# Altium schematic sheet Analogue_Output.SchDoc
size A2; SheetNumber: 15; SheetTotal: 29
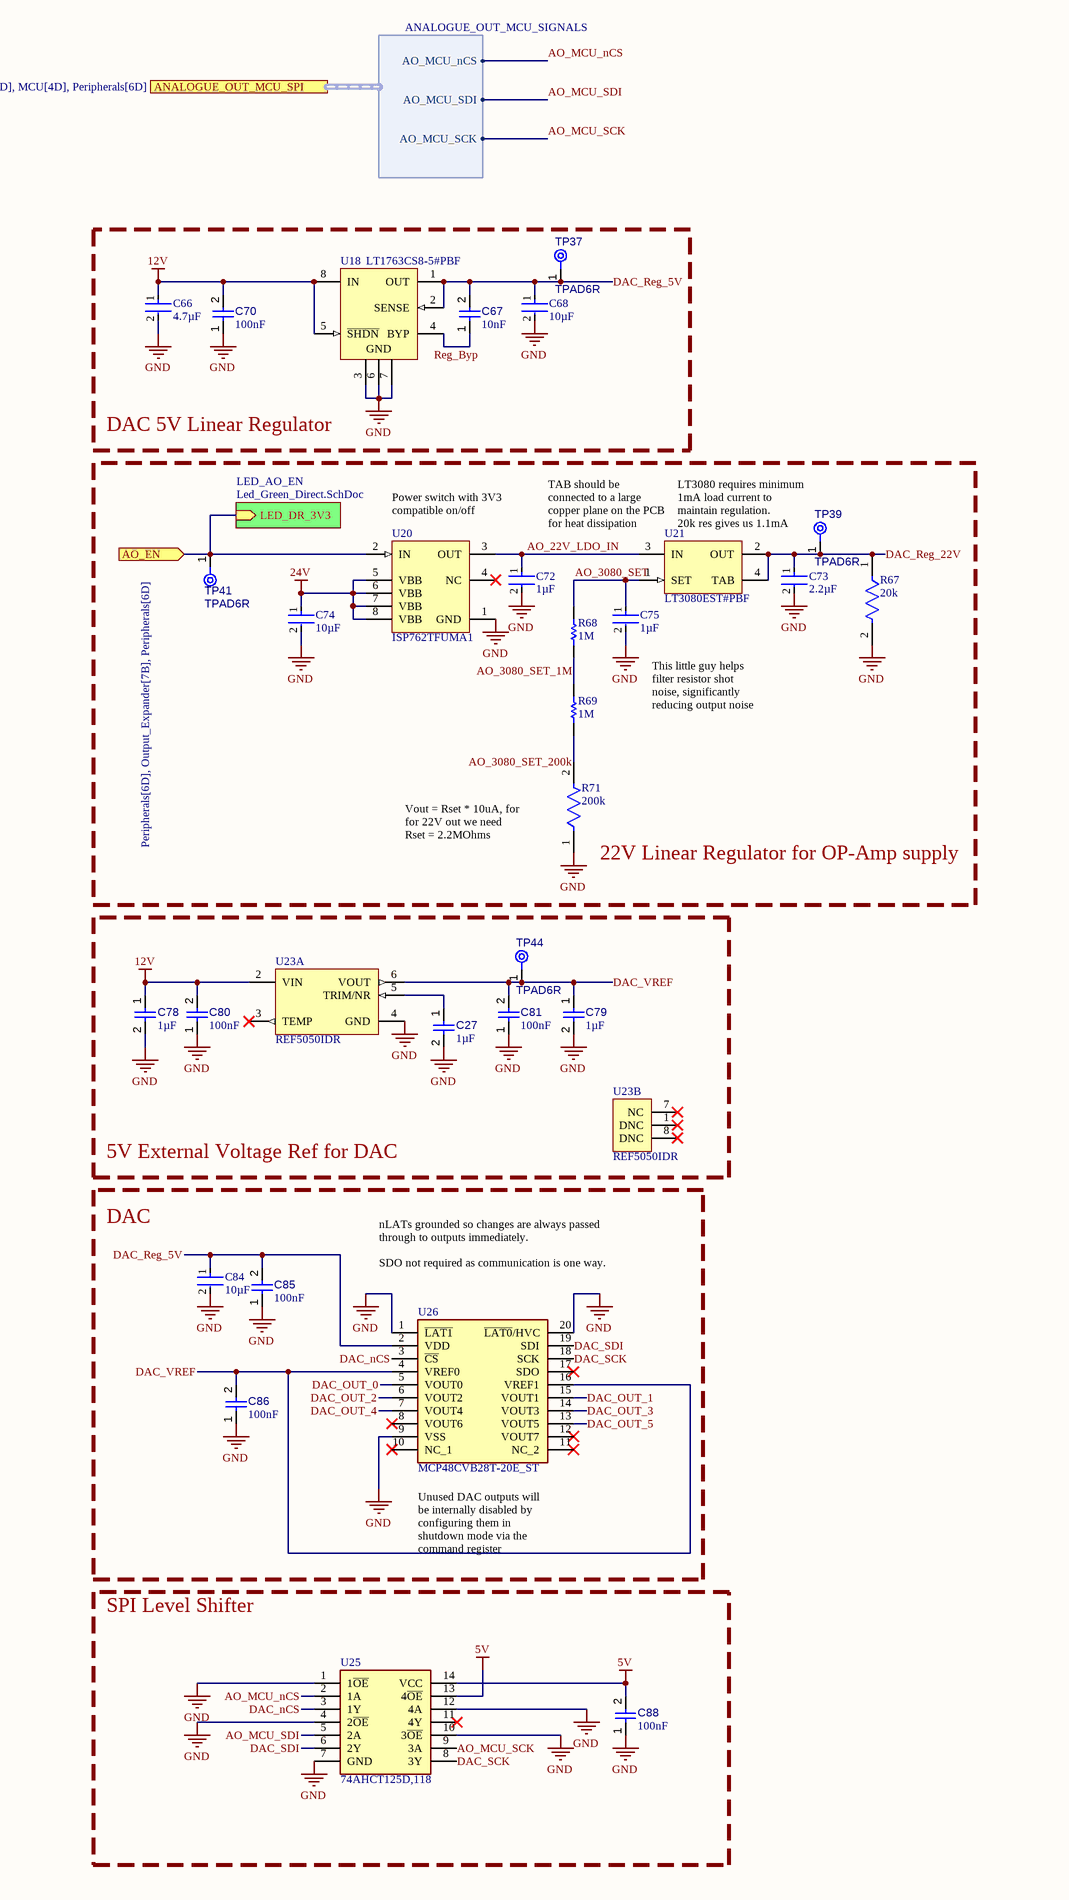
[diagram p0: Analogue_Output.SchDoc, left]
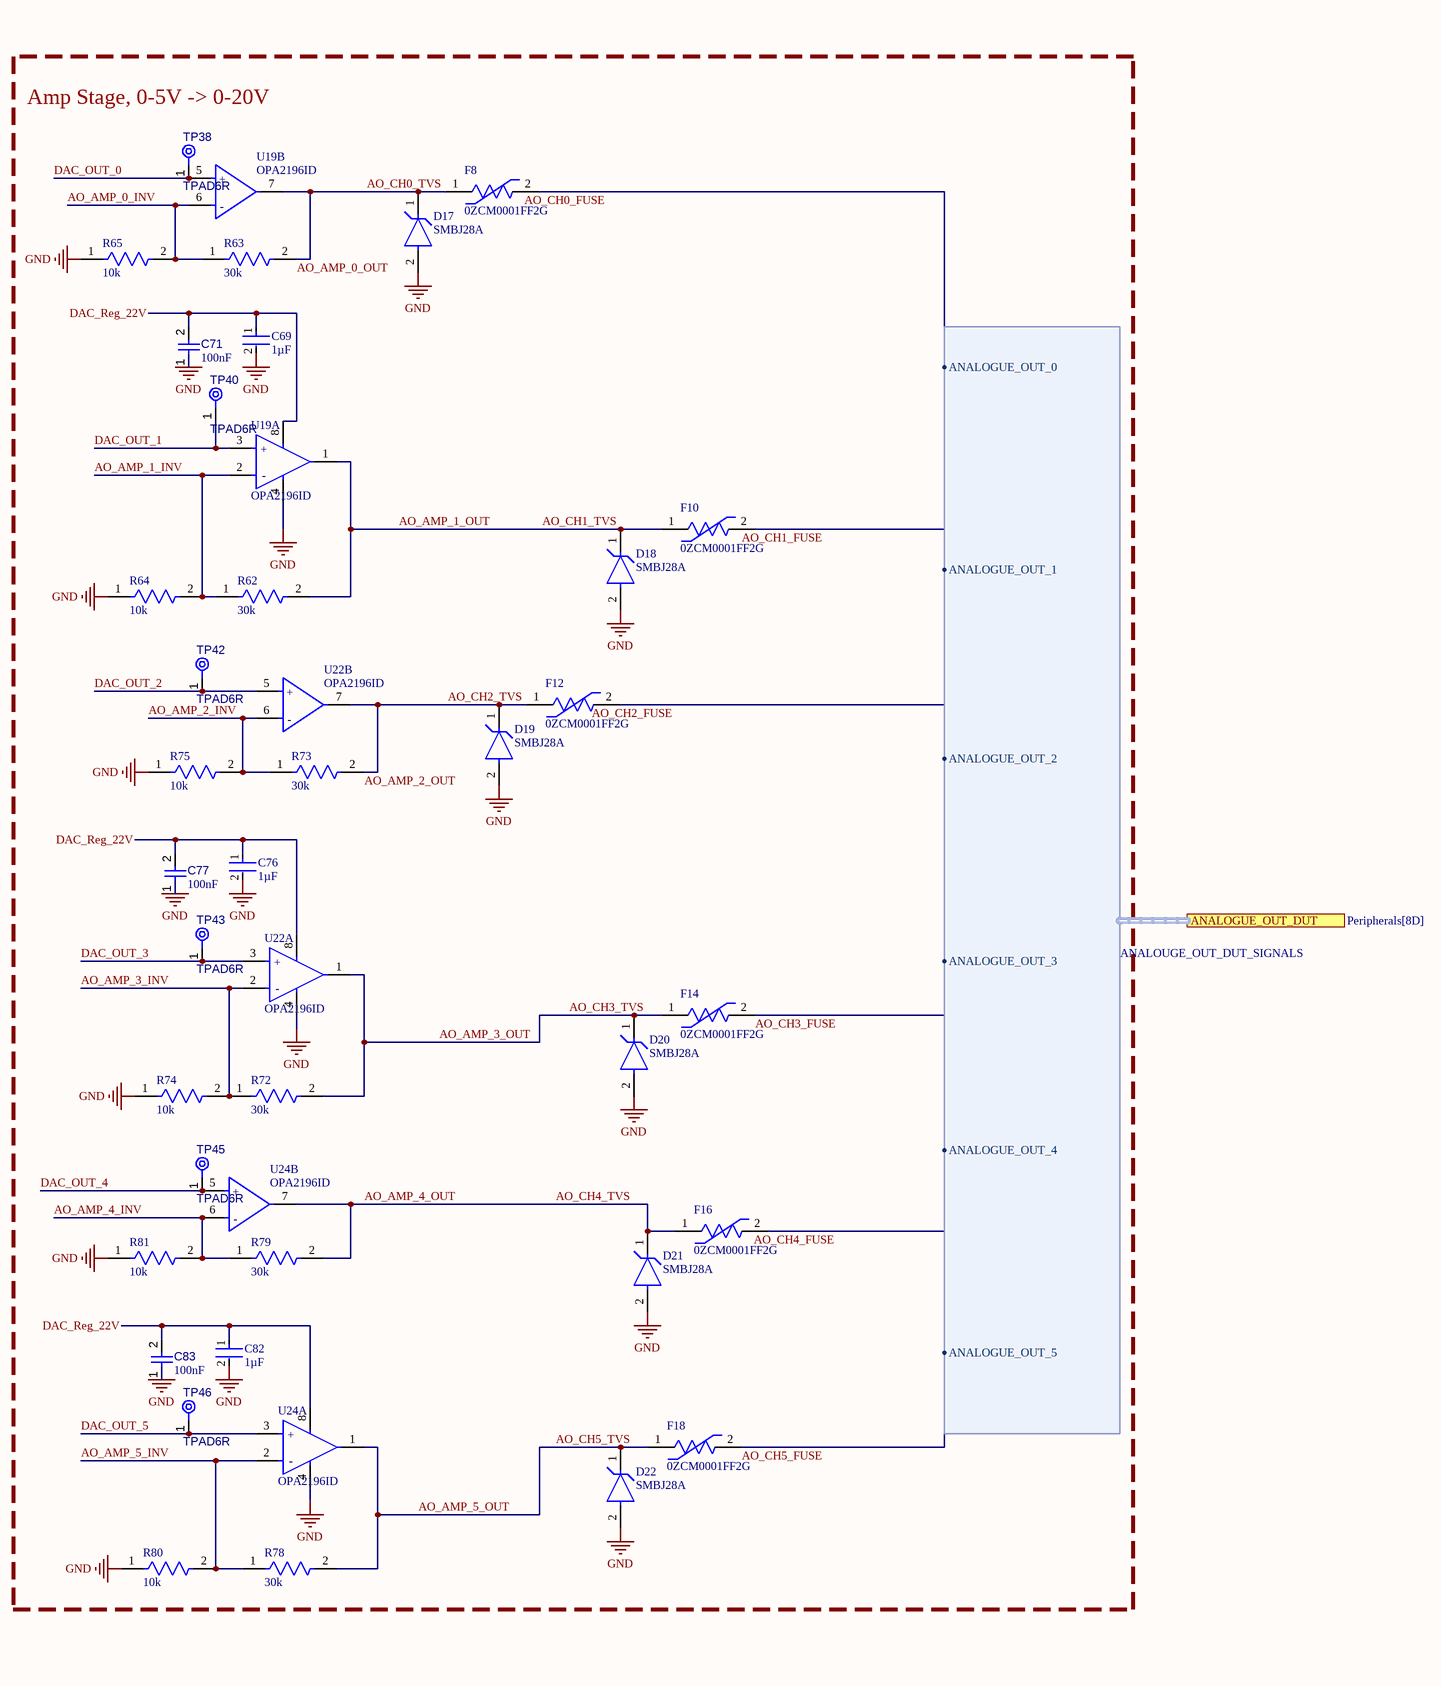
[diagram p1: Analogue_Output.SchDoc, right]

## Parts
C27  value 1µF  [CAPC1608X90X40LL10T20]  (hidden comment: Capacitor 1 uF +/- 10% 25 V 0603)
C66  value 4.7µF  [FP-GRM21B-0_2-e0_2_0_7-MFG]  (hidden comment: GRM21BZ71H475KE15L)
C67  value 10nF  [CAPC0402(1005)60_L]  (hidden comment: Capacitor 10nF +/-20% 50V 0402)
C68  value 10µF  [FP-GRM31C-0_2-e0_3_0_8-IPC_C]  (hidden comment: GRM31CR71E106KA12L)
C69  value 1µF  [FP-CC0603-DB-IPC_B]  (hidden comment: CC0603KRX7R9BB105)
C70  value 100nF  [CAPC1608X90X40NL10T20]  (hidden comment: Capacitor 100 nF +/-10% 50 V 0603)
C71  value 100nF  [CAPC1608X90X40NL10T20]  (hidden comment: Capacitor 100 nF +/-10% 50 V 0603)
C72  value 1µF  [FP-CC0603-DB-IPC_B]  (hidden comment: CC0603KRX7R9BB105)
C73  value 2.2µF  [FP-CC0805-0_85-IPC_A]  (hidden comment: CC0805KKX5R9BB225)
C74  value 10µF  [FP-GRM188-0_2-IPC_C]  (hidden comment: GRM188R6YA106MA73D)
C75  value 1µF  [FP-CC0603-DB-IPC_B]  (hidden comment: CC0603KRX7R9BB105)
C76  value 1µF  [FP-CC0603-DB-IPC_B]  (hidden comment: CC0603KRX7R9BB105)
C77  value 100nF  [CAPC1608X90X40NL10T20]  (hidden comment: Capacitor 100 nF +/-10% 50 V 0603)
C78  value 1µF  [CAPC1608X90X40LL10T20]  (hidden comment: Capacitor 1 uF +/- 10% 25 V 0603)
C79  value 1µF  [CAPC1608X90X40LL10T20]  (hidden comment: Capacitor 1 uF +/- 10% 25 V 0603)
C80  value 100nF  [CAPC1608X90X40NL10T20]  (hidden comment: Capacitor 100 nF +/-10% 50 V 0603)
C81  value 100nF  [CAPC1608X90X40NL10T20]  (hidden comment: Capacitor 100 nF +/-10% 50 V 0603)
C82  value 1µF  [FP-CC0603-DB-IPC_B]  (hidden comment: CC0603KRX7R9BB105)
C83  value 100nF  [CAPC1608X90X40NL10T20]  (hidden comment: Capacitor 100 nF +/-10% 50 V 0603)
C84  value 10µF  [FP-GRM31C-0_2-e0_3_0_8-IPC_C]  (hidden comment: GRM31CR71E106KA12L)
C85  value 100nF  [CAPC1608X90X40NL10T20]  (hidden comment: Capacitor 100 nF +/-10% 50 V 0603)
C86  value 100nF  [CAPC1608X90X40NL10T20]  (hidden comment: Capacitor 100 nF +/-10% 50 V 0603)
C88  value 100nF  [CAPC1608X90X40NL10T20]  (hidden comment: Capacitor 100 nF +/-10% 50 V 0603)
D17  SMBJ28A  [FP-SMBJ-MFG]
D18  SMBJ28A  [FP-SMBJ-MFG]
D19  SMBJ28A  [FP-SMBJ-MFG]
D20  SMBJ28A  [FP-SMBJ-MFG]
D21  SMBJ28A  [FP-SMBJ-MFG]
D22  SMBJ28A  [FP-SMBJ-MFG]
F8  0ZCM0001FF2G  [FP-0ZCM0001FF2G-MFG]
F10  0ZCM0001FF2G  [FP-0ZCM0001FF2G-MFG]
F12  0ZCM0001FF2G  [FP-0ZCM0001FF2G-MFG]
F14  0ZCM0001FF2G  [FP-0ZCM0001FF2G-MFG]
F16  0ZCM0001FF2G  [FP-0ZCM0001FF2G-MFG]
F18  0ZCM0001FF2G  [FP-0ZCM0001FF2G-MFG]
R62  value 30k  [FP-RT0603-IPC_C]  (hidden comment: RT0603BRE0730KL)
R63  value 30k  [FP-RT0603-IPC_C]  (hidden comment: RT0603BRE0730KL)
R64  value 10k  [FP-RT0603-IPC_C]  (hidden comment: RT0603BRD0710KL)
R65  value 10k  [FP-RT0603-IPC_C]  (hidden comment: RT0603BRD0710KL)
R67  value 20k  [FP-RT0603-IPC_C]  (hidden comment: RT0603DRD0720KL)
R68  value 1M  [RESC2013X60X35ML10T20]  (hidden comment: RT0805BRD071ML)
R69  value 1M  [RESC2013X60X35ML10T20]  (hidden comment: RT0805BRD071ML)
R71  value 200k  [FP-AT0603-IPC_A]  (hidden comment: AT0603BRD07200KL)
R72  value 30k  [FP-RT0603-IPC_C]  (hidden comment: RT0603BRE0730KL)
R73  value 30k  [FP-RT0603-IPC_C]  (hidden comment: RT0603BRE0730KL)
R74  value 10k  [FP-RT0603-IPC_C]  (hidden comment: RT0603BRD0710KL)
R75  value 10k  [FP-RT0603-IPC_C]  (hidden comment: RT0603BRD0710KL)
R78  value 30k  [FP-RT0603-IPC_C]  (hidden comment: RT0603BRE0730KL)
R79  value 30k  [FP-RT0603-IPC_C]  (hidden comment: RT0603BRE0730KL)
R80  value 10k  [FP-RT0603-IPC_C]  (hidden comment: RT0603BRD0710KL)
R81  value 10k  [FP-RT0603-IPC_C]  (hidden comment: RT0603BRD0710KL)
TP37  TPAD6R  [TP06R]  (no BOM)
TP38  TPAD6R  [TP06R]  (no BOM)
TP39  TPAD6R  [TP06R]  (no BOM)
TP40  TPAD6R  [TP06R]  (no BOM)
TP41  TPAD6R  [TP06R]  (no BOM)
TP42  TPAD6R  [TP06R]  (no BOM)
TP43  TPAD6R  [TP06R]  (no BOM)
TP44  TPAD6R  [TP06R]  (no BOM)
TP45  TPAD6R  [TP06R]  (no BOM)
TP46  TPAD6R  [TP06R]  (no BOM)
U18  LT1763CS8-5#PBF  [LT-S8-8_N]
U19  OPA2196ID  [FP-D0008A-IPC_B]  (parts A,B of 2)
U20  ISP762TFUMA1  [INF-PG-DSO-8-3_L]
U21  LT3080EST#PBF  [LT-ST-3-SOT-223_M]
U22  OPA2196ID  [FP-D0008A-IPC_B]  (parts A,B of 2)
U23  REF5050IDR  [D0008A_L]  (parts A,B of 2)
U24  OPA2196ID  [FP-D0008A-IPC_B]  (parts A,B of 2)
U25  74AHCT125D,118  [SOIC127P600X175-14N]
U26  MCP48CVB28T-20E_ST  [SOP65P640X120-20N]

## Blocks framed on the sheet
DAC 5V Linear Regulator: C66-C68 C70 TP37 U18
Amp Stage, 0-5V -> 0-20V: C69 C71 C76 C77 C82 C83 D17-D22 F8 F10 F12 F14 F16 F18 R62-R65 R72-R75 R78-R81 TP38 TP40 TP42 TP43 TP45 TP46 U19 U22 U24
22V Linear Regulator for OP-Amp supply: C72-C75 R67-R69 R71 TP39 TP41 U20 U21
5V External Voltage Ref for DAC: C27 C78-C81 TP44 U23
DAC: C84-C86 U26
SPI Level Shifter: C88 U25

## Sub-sheets
LED_AO_EN = Led_Green_Direct.SchDoc: LED_DR_3V3 (in)

## Ports
ANALOGUE_OUT_DUT (harness ANALOUGE_OUT_DUT_SIGNALS, see Peripherals[8D]), ANALOGUE_OUT_MCU_SPI (harness ANALOGUE_OUT_MCU_SIGNALS, see Peripherals[6D], MCU[4D], Peripherals[6D]), AO_EN (in, see Peripherals[6D], Output_Expander[7B], Peripherals[6D])

## Harnesses
ANALOGUE_OUT_MCU_SIGNALS: AO_MCU_nCS, AO_MCU_SDI, AO_MCU_SCK
ANALOUGE_OUT_DUT_SIGNALS: ANALOGUE_OUT_0, ANALOGUE_OUT_1, ANALOGUE_OUT_2, ANALOGUE_OUT_3, ANALOGUE_OUT_4, ANALOGUE_OUT_5

## Nets
5V: C88.2 U25.13(4~{OE}) U25.14(VCC)
12V: C66.1 C70.2 C78.1 C80.2 U18.5(~{SHDN}) U18.8(IN) U23.2(VIN)
24V: C74.1 U20.5(VBB) U20.6(VBB) U20.7(VBB) U20.8(VBB)
GND: C27.2 C66.2 C68.2 C69.2 C70.1 C71.1 C72.2 C73.2 C74.2 C75.2 C76.2 C77.1 C78.2 C79.2 C80.1 C81.1 C82.2 C83.1 C84.2 C85.1 C86.1 C88.1 D17.2(A) D18.2(A) D19.2(A) D20.2(A) D21.2(A) D22.2(A) R64.1 R65.1 R67.2 R71.1 R74.1 R75.1 R80.1 R81.1 U18.3(GND) U18.6(GND) U18.7(GND) U19.4(V-) U20.1(GND) U22.4(V-) U23.4(GND) U24.4(V-) U25.1(1~{OE}) U25.4(2~{OE}) U25.7(GND) U25.10(3~{OE}) U25.12(4A) U26.1(~{LAT1}) U26.9(VSS) U26.20(~{LAT0}/HVC)
AO_22V_LDO_IN: C72.1 U20.3(OUT) U21.3(IN)
AO_3080_SET: C75.1 R68.1 U21.1(SET)
AO_3080_SET_1M: R68.2 R69.1
AO_3080_SET_200k: R69.2 R71.2
AO_AMP_0_INV: R63.1 R65.2 U19.6(-IN_B)
AO_AMP_0_OUT: D17.1(C) F8.1 R63.2 U19.7(OUT_B)  [also labelled AO_CH0_TVS]
AO_AMP_1_INV: R62.1 R64.2 U19.2(-IN_A)
AO_AMP_1_OUT: D18.1(C) F10.1 R62.2 U19.1(OUT_A)  [also labelled AO_CH1_TVS]
AO_AMP_2_INV: R73.1 R75.2 U22.6(-IN_B)
AO_AMP_2_OUT: D19.1(C) F12.1 R73.2 U22.7(OUT_B)  [also labelled AO_CH2_TVS]
AO_AMP_3_INV: R72.1 R74.2 U22.2(-IN_A)
AO_AMP_3_OUT: D20.1(C) F14.1 R72.2 U22.1(OUT_A)  [also labelled AO_CH3_TVS]
AO_AMP_4_INV: R79.1 R81.2 U24.6(-IN_B)
AO_AMP_4_OUT: D21.1(C) F16.1 R79.2 U24.7(OUT_B)  [also labelled AO_CH4_TVS]
AO_AMP_5_INV: R78.1 R80.2 U24.2(-IN_A)
AO_AMP_5_OUT: D22.1(C) F18.1 R78.2 U24.1(OUT_A)  [also labelled AO_CH5_TVS]
AO_CH0_FUSE: F8.2 ; port ANALOGUE_OUT_DUT.ANALOGUE_OUT_0
AO_CH1_FUSE: F10.2 ; port ANALOGUE_OUT_DUT.ANALOGUE_OUT_1
AO_CH2_FUSE: F12.2 ; port ANALOGUE_OUT_DUT.ANALOGUE_OUT_2
AO_CH3_FUSE: F14.2 ; port ANALOGUE_OUT_DUT.ANALOGUE_OUT_3
AO_CH4_FUSE: F16.2 ; port ANALOGUE_OUT_DUT.ANALOGUE_OUT_4
AO_CH5_FUSE: F18.2 ; port ANALOGUE_OUT_DUT.ANALOGUE_OUT_5
AO_EN: TP41.1(TP) U20.2(IN) ; port AO_EN, sheet LED_AO_EN/LED_DR_3V3
AO_MCU_nCS: U25.2(1A) ; port ANALOGUE_OUT_MCU_SPI.AO_MCU_nCS
AO_MCU_SCK: U25.9(3A) ; port ANALOGUE_OUT_MCU_SPI.AO_MCU_SCK
AO_MCU_SDI: U25.5(2A) ; port ANALOGUE_OUT_MCU_SPI.AO_MCU_SDI
DAC_nCS: U25.3(1Y) U26.3(~{CS})
DAC_OUT_0: TP38.1(TP) U19.5(+IN_B) U26.5(VOUT0)
DAC_OUT_1: TP40.1(TP) U19.3(+IN_A) U26.15(VOUT1)
DAC_OUT_2: TP42.1(TP) U22.5(+IN_B) U26.6(VOUT2)
DAC_OUT_3: TP43.1(TP) U22.3(+IN_A) U26.14(VOUT3)
DAC_OUT_4: TP45.1(TP) U24.5(+IN_B) U26.7(VOUT4)
DAC_OUT_5: TP46.1(TP) U24.3(+IN_A) U26.13(VOUT5)
DAC_Reg_5V: C67.2 C68.1 C84.1 C85.2 TP37.1(TP) U18.1(OUT) U18.2(SENSE) U26.2(VDD)
DAC_Reg_22V: C69.1 C71.2 C73.1 C76.1 C77.2 C82.1 C83.2 R67.1 TP39.1(TP) U19.8(V+) U21.2(OUT) U21.4(TAB) U22.8(V+) U24.8(V+)
DAC_SCK: U25.8(3Y) U26.18(SCK)
DAC_SDI: U25.6(2Y) U26.19(SDI)
DAC_VREF: C79.1 C81.2 C86.2 TP44.1(TP) U23.6(VOUT) U26.4(VREF0) U26.16(VREF1)
Reg_Byp: C67.1 U18.4(BYP)
NetC27_1: C27.1 U23.5(TRIM/NR)

Not connected (* = marked no-connect by the designer): U20 4(NC)*; U23 1(DNC)* 3(TEMP)* 7(NC)* 8(DNC)*; U25 11(4Y)*; U26 8(VOUT6)* 10(NC_1)* 11(NC_2)* 12(VOUT7)* 17(SDO)*

## Notes on the sheet
- (near U20) Power switch with 3V3 compatible on/off
- (near U21) TAB should be connected to a large copper plane on the PCB for heat dissipation
- LT3080 requires minimum 1mA load current to maintain regulation.
  20k res gives us 1.1mA
- (near C75) This little guy helps filter resistor shot noise, significantly reducing output noise
- Vout = Rset * 10uA, for for 22V out we need Rset = 2.2MOhms
- nLATs grounded so changes are always passed through to outputs immediately.
  SDO not required as communication is one way.
- (near U26) Unused DAC outputs will be internally disabled by configuring them in shutdown mode via the command register
- (in symbol CMP-014-00008-1, part A) +; -
- (in symbol CMP-014-00008-1, part B) +; -

## Library data of the parts
C27 C78 C79 = CMP-001-00005-6: Chip Capacitor, 1 uF, +/- 10%, 25 V, 0603 (1608 Metric); Capacitor Type: Ceramic; Voltage Rating: 25V; Pins: 2; Mounting Technology: SM; RoHS Compliant: True; Max Operating Temperature: 125°C; Case/Package: 0603; Min Operating Temperature: -55°C; Tolerance: 10%
C66 = CMP-001-00149-1: 50V 4.7uF X7R ±10% 0805 Multilayer Ceramic Capacitors MLCC - SMD/SMT ROHS; Manufacturer Lifecycle Status: IN PRODUCTION; Case/Package: 0805; Tolerance: 10%; Voltage Rating: 50V; Min Operating Temperature: -55°C; Mounting Technology: Surface Mount; Max Operating Temperature: 125°C; Country of Origin: Japan, Mainland China, Philippines, Singapore, Thailand; Dielectric Material: Ceramic; Export Control Classification Number (ECCN) Code: EAR99; Harmonized Tariff Schedule (HTS) Code: 8532.24.00.20; Height: 1.25mm; Introduction Date: 2017-02-22; Length: 2mm; Lifecycle Status: Production; Material: Ceramic; Number of Terminals: 2; REACH SVHC: Yes; RoHS: Compliant; Thickness: 1.25mm; Voltage Rating (DC): 50V; Width: 1.25mm
C67 = CMP-001-00069-3: Chip Capacitor, 10nF +/-20%, 50V, 0402, Thickness 0.6 mm; Tolerance: 5%; Max Operating Temperature: 85°C; Pins: 2; Case/Package: 0402; Voltage Rating: 50V; Min Operating Temperature: -55°C; Mounting Technology: SMT
C68 C84 = CMP-001-00139-1: 25V 10uF X7R ±10% 1206 Multilayer Ceramic Capacitors MLCC - SMD/SMT ROHS; Manufacturer Lifecycle Status: IN PRODUCTION; Min Operating Temperature: -55°C; Case/Package: 1206; Pins: 2; Voltage Rating: 25V; Max Operating Temperature: 125°C; Tolerance: 10%; Mounting Technology: Surface Mount; Case Code (Imperial): 1206; Case Code (Metric): 3216; China RoHS: Compliant; Depth: 1.6mm; Dielectric Material: Ceramic; Dielectric: X7R; Height: 1.6mm; Lead Free: Lead Free; Length: 3.2mm; Lifecycle Status: Production; Material: Ceramic; Number of Terminals: 2; Packaging: Cut Tape; Radiation Hardening: No; REACH SVHC: Yes; RoHS: Compliant; Schedule B: 8532240020, 8532240020; Termination: SMD/SMT; Thickness: 1.6mm; Voltage Rating (DC): 25V; Voltage: 25V; Width: 1.6mm
C69 C72 C75 C76 C82 = CMP-001-00123-1: 50V 1uF X7R ±10% 0603 Multilayer Ceramic Capacitors MLCC - SMD/SMT ROHS; Length: 1.6mm; Introduction Date: 2014-07-08; Country of Origin: Mainland China, Taiwan; Voltage Rating (DC): 50V; Mounting Technology: Surface Mount; Export Control Classification Number (ECCN) Code: EAR99; Tolerance: 10%; Material: Ceramic; Min Operating Temperature: -55°C; Lifecycle Status: Production; REACH SVHC: Yes; Packaging: Tape & Reel (TR); Max Operating Temperature: 125°C; Schedule B: 8532240020, 8532240020; Dielectric: X7R; Voltage Rating: 50V; Case Code (Imperial): 0603; Harmonized Tariff Schedule (HTS) Code: 8532.24.00.20; Number of Terminals: 2; China RoHS: Compliant; Lead Free: Lead Free; RoHS: Compliant; Height: 800µm; Composition: Ceramic; Termination: SMD/SMT; Halogen Free: Halogen Free; Weight: 2.012816mg; Case Code (Metric): 1608; Dielectric Material: Ceramic; Case/Package: 0603; Width: 800µm; Thickness: 889µm
C70 C71 C77 C80 C81 C83 C85 C86 C88 = CMP-001-00017-6: Chip Capacitor, 100 nF, +/- 10%, 50 V, 0603 (1608 Metric); Voltage Rating: 50V; Capacitor Type: Ceramic; Tolerance: 10%; Mounting Technology: SM; Max Operating Temperature: 125°C; RoHS Compliant: True; Pins: 2; Case/Package: 0603; Min Operating Temperature: -55°C
C73 = CMP-001-00134-1: 50V 2.2uF X5R ±10% 0805 Multilayer Ceramic Capacitors MLCC - SMD/SMT ROHS; Manufacturer Package Identifier: CC0805-0.85; Min Operating Temperature: -55°C; Export Control Classification Number (ECCN) Code: EAR99; Case Code (Metric): 2012; Voltage Rating: 50V; Case Code (Imperial): 0805; China RoHS: Compliant; REACH SVHC: Yes; Packaging: Cut Tape (CT); Mounting Technology: Surface Mount; Max Operating Temperature: 85°C; Case/Package: 0805; Dielectric: X5R; Voltage Rating (DC): 50V; Material: Ceramic; Width: 1.25mm; Composition: Ceramic; Introduction Date: 2014-07-08; Length: 2mm; Termination: SMD/SMT; Halogen Free: Halogen Free; Height: 1.25mm; Thickness: 1.4478mm; Country of Origin: Mainland China, Taiwan; RoHS: Compliant; Lifecycle Status: Production; Tolerance: 10%; Number of Terminals: 2; Dielectric Material: Ceramic; Weight: 5.499807mg; Lead Free: Lead Free; Harmonized Tariff Schedule (HTS) Code: 8532.24.00.20
C74 = CMP-001-00121-1: 35V 10uF X5R ±20% 0603 Multilayer Ceramic Capacitors MLCC - SMD/SMT ROHS; Manufacturer Lifecycle Status: IN PRODUCTION; Case/Package: 0603; Width: 800µm; Dielectric Material: Ceramic; Min Operating Temperature: -55°C; Length: 1.6mm; Tolerance: 20%; Number of Terminals: 2; Material: Ceramic; Max Operating Temperature: 85°C; REACH SVHC: Yes; Voltage Rating (DC): 35V; Voltage Rating: 35V; Case Code (Metric): 1608; Mounting Technology: Surface Mount; Dielectric: X5R; Schedule B: 8532240020, 8532240020; Lifecycle Status: Production; Thickness: 800µm; RoHS: Compliant; Height: 800µm; Case Code (Imperial): 0603
D17-D22 = CMP-004-00070-1: Tvs Diodes & Esd Suppressors; SMBJ28A; Littelfuse; 28 V; 45.4 V; 31.1 V; 31.1 V; Power Line Protection: No; Clamping Voltage: 45.4V; Number of Channels: 1; Power Rating: 600W; Voltage Rating (DC): 28V; Polarity: Unidirectional; Breakdown Voltage: 32.75V; Element Configuration: Single; Leakage Current: 1µA; Current: 1mA; Max Breakdown Voltage: 34.4V; Forward Voltage: 3.5V; Max Power Dissipation: 5W; Min Breakdown Voltage: 31.1V; Max Junction Temperature (Tj): 150°C; Max Surge Current: 13.3A; Height: 2.61mm; Number of Elements: 1; Power Dissipation: 600W; Case/Package: SMB; Termination: SMD/SMT; Radiation Hardening: No; Mounting Technology: Surface Mount; Lifecycle Status: Production; Direction: Unidirectional; Number of Unidirectional Channels: 1; Reverse Voltage: 28V; Peak Reverse Current: 1µA; Voltage: 28V; Operating Supply Voltage: 28V; Min Operating Temperature: -65°C; Schedule B: 8541100080, 8541100080; REACH SVHC: No; Length: 4.57mm; Packaging: Cut Tape; Country of Origin: Mainland China, Philippines; Test Current: 1mA; Introduction Date: 1996-01-01; Lead Free: Lead Free; Max Operating Temperature: 150°C; Composition: Zener; Pins: 2; Width: 3.94mm; Number of Terminals: 2; Reverse Standoff Voltage: 28V; Harmonized Tariff Schedule (HTS) Code: 8541.10.00.50; RoHS: Compliant; Peak Pulse Power: 600W; Export Control Classification Number (ECCN) Code: EAR99; Max Reverse Leakage Current: 1µA; Reverse Breakdown Voltage: 31.1V; Peak Pulse Current: 13.3A
F8 F10 F12 F14 F16 F18 = CMP-005-00023-1: Prices include import duty and tax. RESETTABLE PTC FUSE, SMD, 0603 SIZE, 10MA, 60V;; Trip Current: 30mA; Value: 15Ω; Maximum Resistance 1 Hour (R1max): 100Ω; Ratings: AEC-Q200, TUV; Time to Trip: 1s; Current Rating: 40A; REACH SVHC: Yes; Voltage Rating: 60V; Harmonized Tariff Schedule (HTS) Code: 8533.40.80.70; Mounting Technology: Surface Mount; Length: 1.8mm; Min Operating Temperature: -40°C; Max Operating Temperature: 85°C; Width: 1mm; Export Control Classification Number (ECCN) Code: EAR99; Height: 850µm; Working Voltage: 60V; Case/Package: 0603; RoHS: Compliant; Lifecycle Status: Production; Hold Current: 10mA; Number of Terminals: 2; China RoHS: Compliant; Introduction Date: 2019-09-26
R62 R63 R72 R73 R78 R79 = CMP-009-00272-1: 100mW Thin Film Resistor ±50ppm/℃ ±0.1% 30kΩ 0603 Chip Resistor - Surface Mount ROHS; Working Voltage: 75V; Voltage Rating (DC): 50V; Temperature Coefficient: 50ppm/°C; REACH SVHC: Yes; Case/Package: 0603; Max Power Dissipation: 100mW; Packaging: Tape & Reel (TR); Tolerance: 0.1%; Introduction Date: 2008-07-11; Height: 450µm; Case Code (Metric): 0603; Max Operating Temperature: 155°C; Country of Origin: Mainland China, Taiwan; Min Operating Temperature: -55°C; Power Rating: 100mW; Mounting Technology: Surface Mount; China RoHS: Non-Compliant; Military Standard: Not; Composition: Thin Film; Harmonized Tariff Schedule (HTS) Code: 8533.21.00.30; Lead Free: Lead Free; RoHS: Compliant; Depth: 800µm; Length: 1.6mm; Width: 800µm; Lifecycle Status: Production; Number of Terminals: 2; Number of Terminations: 2; Voltage Rating: 75V; Export Control Classification Number (ECCN) Code: EAR99
R64 R65 R74 R75 R80 R81 = CMP-009-00322-1: Res Thin Film 0603 10K Ohm 0.1% 1/10W |25ppm/|C SMD Paper T/R; Power Rating: 100mW; Voltage Rating: 75V; Temperature Coefficient: 25ppm/°C; Width: 800µm; Country of Origin: Mainland China, Taiwan; Military Standard: Not; China RoHS: Non-Compliant; Composition: Thin Film; Schedule B: 8533210045, 8533210045; Max Operating Temperature: 155°C; Export Control Classification Number (ECCN) Code: EAR99; Lead Free: Lead Free; Number of Terminals: 2; Voltage Rating (DC): 75V; Introduction Date: 2008-06-09; Tolerance: 0.1%; Number of Terminations: 2; Case/Package: 0603; Depth: 800µm; Max Power Dissipation: 100mW; RoHS: Compliant; Harmonized Tariff Schedule (HTS) Code: 8533.21.00.30; Lifecycle Status: Production; Length: 1.6mm; Min Operating Temperature: -55°C; Features: Moisture Resistant; Case Code (Imperial): 0603; REACH SVHC: Yes; Mounting Technology: Surface Mount; Working Voltage: 75V; Height: 450µm; Termination: SMD/SMT; Weight: 2.012816mg
R67 = CMP-009-00320-1: 100mW Thin Film Resistor 75V ±0.5% ±25ppm/℃ 20kΩ 0603 Chip Resistor - Surface Mount ROHS; Temperature Coefficient: 25ppm/°C; Voltage Rating (DC): 50V; Lifecycle Status: Production; Min Operating Temperature: -55°C; Schedule B: 8533210045, 8533210045; Power Rating: 100mW; Length: 1.6mm; Voltage Rating: 75V; Working Voltage: 75V; China RoHS: Non-Compliant; Case Code (Metric): 0603; Number of Terminals: 2; RoHS: Compliant; Mounting Technology: Surface Mount; Max Operating Temperature: 155°C; Case/Package: 0603; Height: 450µm; REACH SVHC: Yes; Width: 800µm; Lead Free: Lead Free; Tolerance: 0.5%; Composition: Thin Film
R68 R69 = CMP-009-00356-1: RES SMD 1M OHM 0.1% 1/8W 0805 / 1 MOhms ±0.1% 0.125W, 1/8W Chip Resistor 0805 (2012 Metric) Thin Film; Voltage Rating: 150V; Max Power Dissipation: 125mW; Temperature Coefficient: 25ppm/°C; Lifecycle Status: Production; Manufacturer Package Identifier: 0805 (2012 metric); Harmonized Tariff Schedule (HTS) Code: 8533.21.00.30; Mounting Technology: Surface Mount; Number of Terminations: 2; Export Control Classification Number (ECCN) Code: EAR99; Introduction Date: 2008-06-09; Country of Origin: Mainland China, Taiwan; Termination: SMD/SMT; RoHS: Compliant; Military Standard: Not; Case Code (Imperial): 0805; Features: Moisture Resistant; China RoHS: Non-Compliant; Schedule B: 8533210045, 8533210045; Lead Free: Lead Free; Length: 2mm; Voltage Rating (DC): 150V; Working Voltage: 150V; Max Operating Temperature: 155°C; Weight: 5.499807mg; Tolerance: 0.1%; Width: 1.25mm; Depth: 1.25mm; REACH SVHC: Yes; Composition: Thin Film; Power Rating: 125mW; Number of Terminals: 2; Min Operating Temperature: -55°C; Height: 500µm; Case/Package: 0805
R71 = CMP-009-00344-1: 100mW Thin Film Resistor ±25ppm/℃ ±0.1% 200kΩ 0603 Chip Resistor - Surface Mount ROHS; Voltage Rating: 75V; Temperature Coefficient: 25ppm/°C; Lifecycle Status: Production; Length: 1.6mm; Min Operating Temperature: -55°C; Number of Terminals: 2; Width: 800µm; Introduction Date: 2015-05-11; Mounting Technology: Surface Mount; Features: Anti-Sulfur, Automotive AEC-Q200, Moisture Resistant; Country of Origin: Mainland China, Taiwan; Tolerance: 0.1%; Export Control Classification Number (ECCN) Code: EAR99; Max Power Dissipation: 100mW; RoHS: Compliant; Power Rating: 100mW; Case/Package: 0603; Number of Terminations: 2; Working Voltage: 75V; Composition: Thin Film; REACH SVHC: Yes; Harmonized Tariff Schedule (HTS) Code: 8533.21.00.30; Max Operating Temperature: 155°C; China RoHS: Compliant; Height: 450µm; Ratings: AEC-Q200
TP37-TP46 = CMP-00028-00002-2: 0.6mm round; Pins: 1
U18 = CMP-019-00063-1: LDO Regulator Pos 5V 0.5A Automotive 8-Pin SOIC N Tube / IC REG LDO 5V 0.5A 8SOIC; Manufacturer Lifecycle Status: PRODUCTION; Number of Outputs: 1; Min Current Limit: 520mA; Output Type: Fixed; Max Output current: 500mA; Power Supply Rejection Ratio (PSRR): 65dB; Dropout Voltage: 300mV; Min Input Voltage: 1.8V; Max Supply Voltage: 20V; Polarity: Positive; Quiescent Current: 30µA; Length: 5mm; Min Operating Temperature: -40°C; Max Operating Temperature: 125°C; Height: 1.498mm; Schedule B: 8542390000, 8542390000; Lead Free: Lead Free; Output Current: 500mA; Number of Channels: 1; REACH SVHC: No; Number of Regulators: 1; Pins: 8; Width: 3.988mm; RoHS: Compliant; Output Voltage: 5V; Nominal Output Voltage: 5V; Operating Supply Current: 30µA; Lifecycle Status: Production
U19 U22 U24 = CMP-014-00008-1: IC OPAMP GP 2 CIRCUIT 8SOIC / General Purpose Amplifier 2 Circuit Rail-to-Rail 8-SOIC; Manufacturer Lifecycle Status: ACTIVE; Input Offset Voltage (Vos): 25µV; Slew Rate: 6.5V/µs; Max Junction Temperature (Tj): 150°C; Output Current per Channel: 65mA; Min Dual Supply Voltage: 2.25V; Min Supply Voltage: 4.5V; Max Supply Voltage: 36V; Max Dual Supply Voltage: 18V; Nominal Supply Current: 140µA; Number of Channels: 2; Response Time: 700ns; Input Bias Current: 5pA; Bandwidth: 2.2MHz; RoHS: Compliant; Length: 4.9mm; Height: 1.75mm; Width: 3.91mm; Case/Package: SOIC; Thickness: 1.58mm; Lifecycle Status: Production; Max Operating Temperature: 125°C; Min Operating Temperature: -40°C; Pins: 8
U20 = CMP-019-00065-1: ISP452 Series 34 V 100 mOhm SMT Smart Power High Side Switch - PG-DSO-8; Operating Supply Voltage: 20V; Max Power Dissipation: 1.5W; Number of Outputs: 1; Output Current per Channel: 2.4A; Max Supply Current: 500µA; Nominal Supply Voltage: 41V; Min Supply Voltage: 5V; Value: 70mΩ; Voltage: 16V; On-State Resistance: 100mΩ; Max Output current: 8.5A; Output Current: 2A; Max Supply Voltage: 34V; Length: 5mm; Packaging: Tape & Reel; Introduction Date: 2006-03-09; Schedule B: 8542390000; China RoHS: Compliant; Height - Seated (Max): 1.75mm; Number of Channels: 1; Case/Package: SOP; Height: 1.45mm; Power Dissipation: 1.5W; Number of Circuits: 1; Country of Origin: Malaysia; Radiation Hardening: No; Package Quantity: 2500; Current: 2.4A; Max Operating Temperature: 85°C; Width: 4mm; Pins: 8; Lifecycle Status: Production; Harmonized Tariff Schedule (HTS) Code: 8542.39.00.60; REACH SVHC: Yes; Number of Transmitters: 1; Min Operating Temperature: -30°C; Number of Terminals: 8; Export Control Classification Number (ECCN) Code: EAR99; Terminal Pitch: 1.27mm; Load Current: 2.4A; RoHS: Compliant; Nominal Supply Current: 500µA; Temperature Grade: Commercial Extended
U21 = CMP-019-00061-1: LDO Regulator Pos 0V to 30V 1.1A Automotive 4-Pin(3+Tab) SOT-223; Manufacturer Lifecycle Status: PRODUCTION; Output Type: Adjustable; Number of Channels: 1; Reference Voltage: 5mV; Quiescent Current: 500µA; Max Output Voltage: 36V; Output Voltage Accuracy: 1%; Min Input Voltage: 1.2V; Operating Supply Current: 300µA; Polarity: Positive; Width: 3.71mm; Max Operating Temperature: 125°C; Pins: 3; Max Supply Voltage: 36V; Number of Regulators: 1; Max Output current: 1.1A; Number of Outputs: 1; Min Current Limit: 1.1A; RoHS: Compliant; Height: 1.7mm; REACH SVHC: No; Output Current: 1.1A; Lead Free: Lead Free; Min Operating Temperature: -40°C; Schedule B: 8542390000, 8542390000; Min Output Voltage: 0V; Lifecycle Status: Production; Length: 6.71mm
U23 = CMP-019-00067-1: Low-noise, very low-drift, wide-VIN precision voltage reference 8-SOIC -40 to 125; Manufacturer Lifecycle Status: ACTIVE; Quiescent Current: 800µA; Max Output current: 10mA; Tolerance: 0.05%; Temperature Coefficient: 3ppm/°C; Output Type: Fixed; Output Voltage: 5V; Operating Supply Current: 1.2mA; Max Supply Voltage: 18V; Min Input Voltage: 5.2V; Reference Type: Series; Length: 4.9mm; Min Operating Temperature: -40°C; Radiation Hardening: No; Case/Package: SOIC; Pins: 8; Output Current: 10mA; Nominal Supply Current: 800µA; Max Operating Temperature: 125°C; Max Output Voltage: 5V; Weight: 75.891673mg; Schedule B: 8542390000; Width: 3.91mm; Lead Free: Lead Free; Min Output Voltage: 5V; Packaging: Tape & Reel (TR); Lifecycle Status: Production; Thickness: 1.58mm; Height: 1.75mm; RoHS: Compliant
U25 = 74AHCT125D,118: Integrated Circuit; Manufacturer_Name: Nexperia; Datasheet Link: https://assets.nexperia.com/documents/data-sheet/74AHC_AHCT125.pdf; Height: 1.75mm; Manufacturer_Part_Number: 74AHCT125D,118; Mouser Part Number: 771-AHCT125D118; Mouser Price/Stock: https://www.mouser.co.uk/ProductDetail/Nexperia/74AHCT125D118?qs=P62ublwmbi8WxHlonNNcrA%3D%3D; Arrow Part Number: 74AHCT125D,118; Arrow Price/Stock: https://www.arrow.com/en/products/74ahct125d118/nexperia?region=nac
U26 = CMP-031-00024-1: Digital to Analog Converters - DAC Qctal Channel; Manufacturer_Name: Microchip; Manufacturer_Part_Number: MCP48CVB28T-20E/ST; Mouser Price/Stock: https://www.mouser.co.uk/ProductDetail/Microchip-Technology/MCP48CVB28T-20E-ST?qs=W%2FMpXkg%252BdQ6AZUXaqyjWrA%3D%3D; Mouser Part Number: 579-MCP48CVB28T20EST; Source: MAX17643ATC+.SchLib; Height: 1.2mm; Datasheet Link: https://ww1.microchip.com/downloads/aemDocuments/documents/MSLD/ProductDocuments/DataSheets/MCP48CXBX4_8-Family-Data-Sheet-20006556B.pdf; Design Item ID: MCP48CVB28T-20E_ST